# EasyEDA Pro project ProPrj_Zephyr_2026-01-05.epro, board PCB1_4
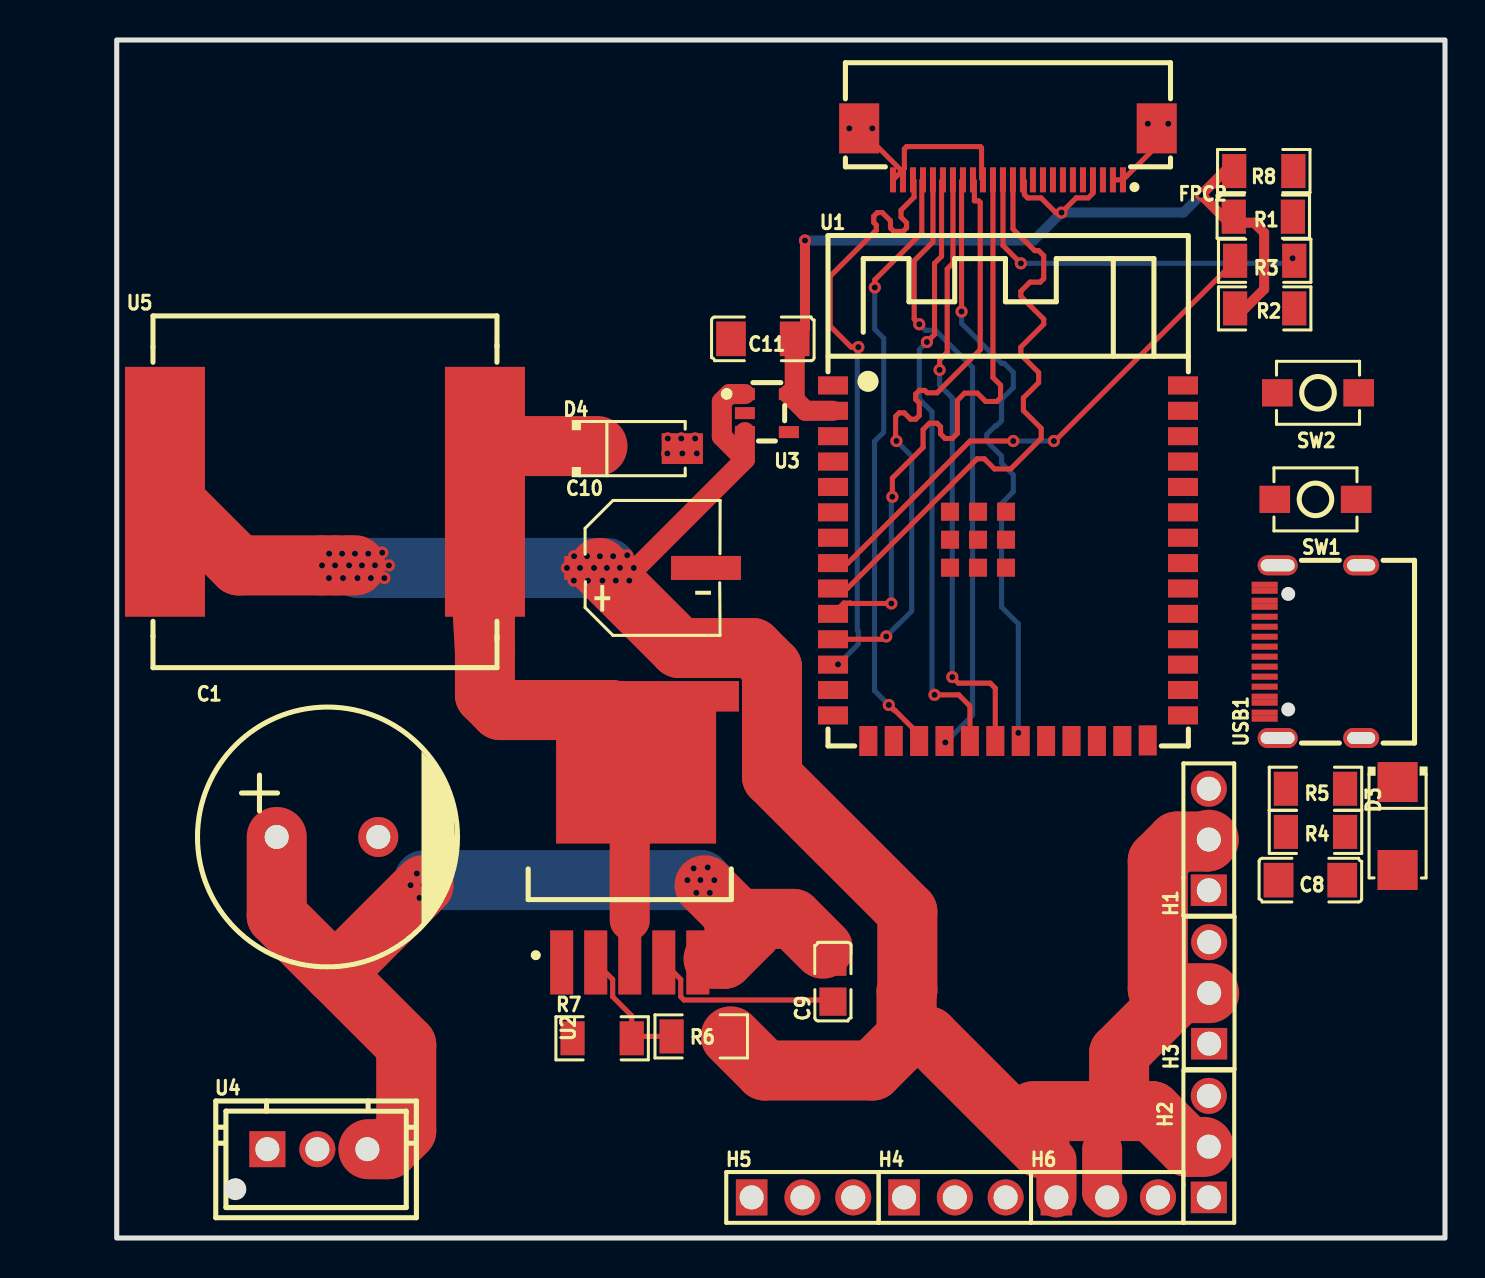
[diagram p5: board, top side]
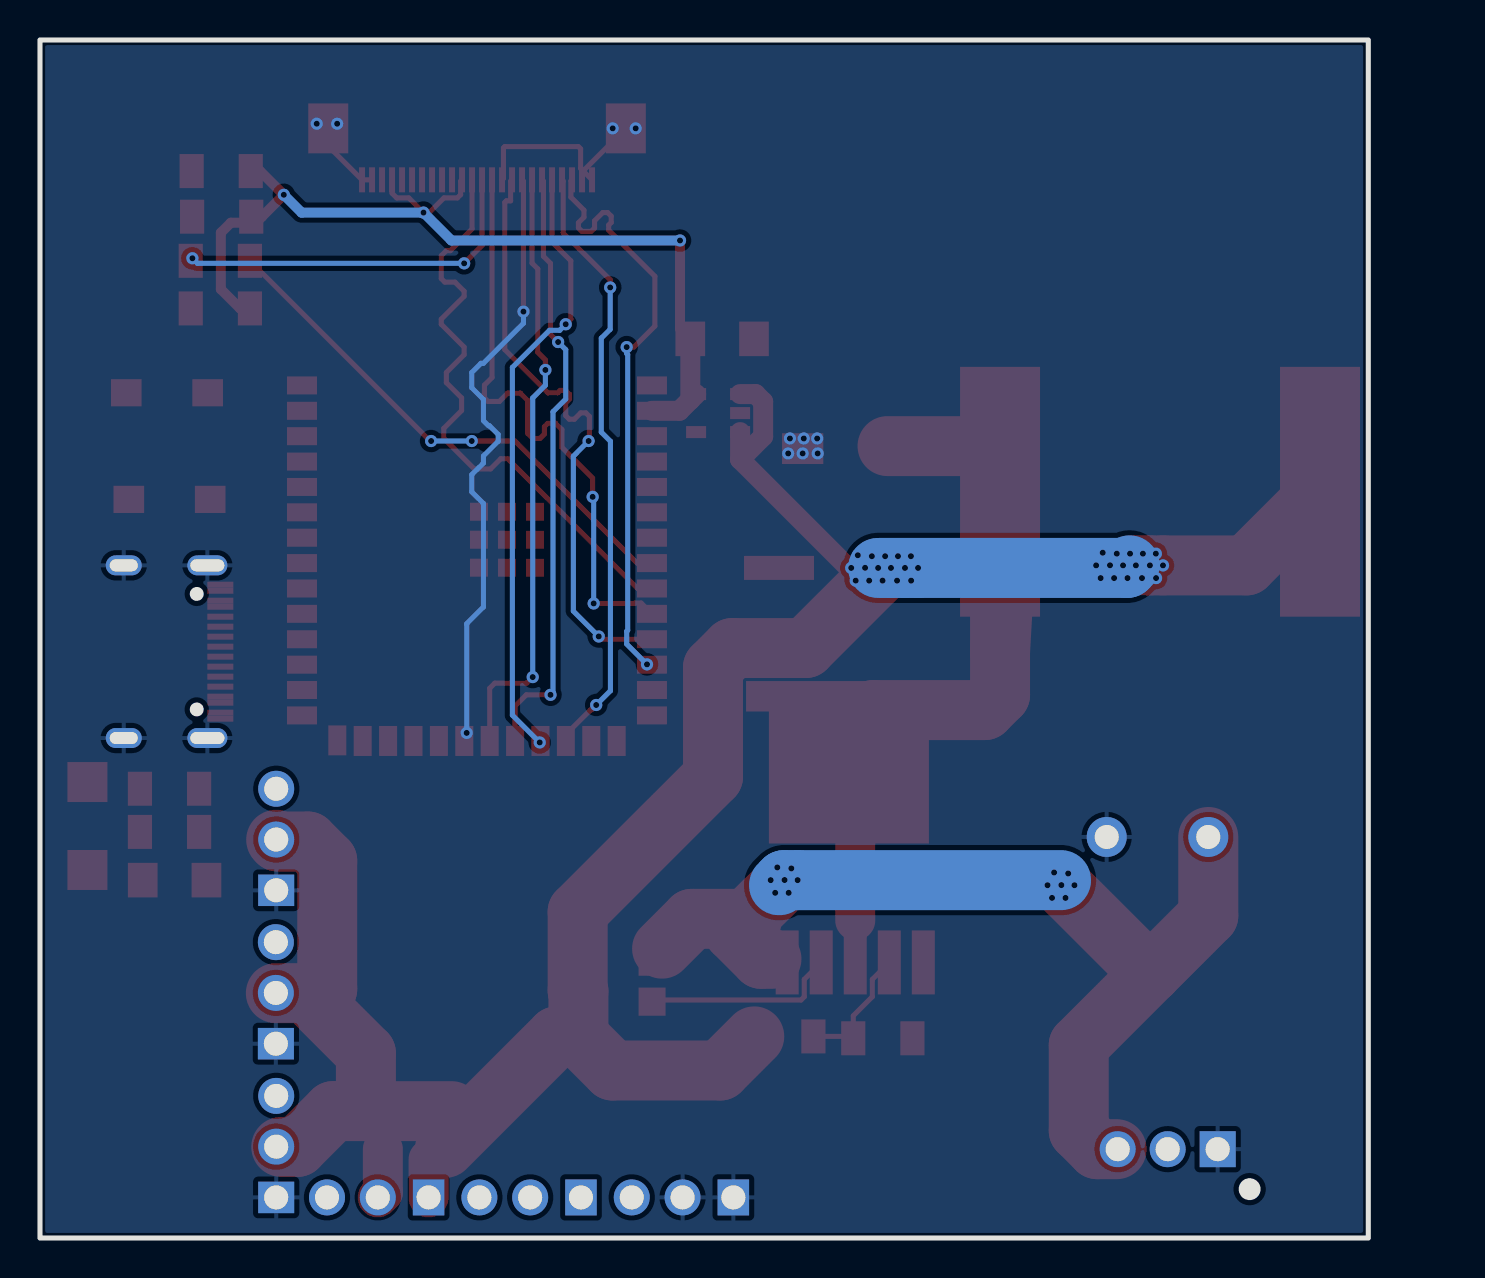
[diagram p6: board, bottom side, seen from below]

Outline 66.42 x 59.94 mm; copper layers: Top Layer, Bottom Layer. Coordinates in mm from the lower left corner of the outline.
Outline path: rectangle 0,59.94 66.42,0
Stack: Top Layer 0.035mm / Dielectric1 1.51mm FR4 er 4.5 / Bottom Layer 0.035mm

## Design rules (mm)
template: Custom Config
spacing copperThickness1oz (default): track to track 0.102, other pairs 0.152 to 0.3
spacing copperThickness2oz: track to track 0.203, other pairs 0.152 to 0.3
track width copperThickness1oz (default): min 0.127, default 0.254, max 2.54
track width copperThickness2oz: min 2, default 3, max 5
differential pair differentialPair (default): width min 0.127, default 0.254, max 2.54; gap min 0.152, default 0.152
via viaSize (default): diameter min 0.5, default 0.61, max 10; hole min 0.3, default 0.305, max 6.3

## Placement (name value [footprint] x y rotation side)
C1  2200uF  [CAP-TH_BD13.0-P5.00-D1.2-FD]  10.54 20.07 0 top
C8  1uF  [C1206]  59.69 17.91 0 top
C9  1uF  [C0805]  35.81 12.83 90 top
C10  470uF  [CAP-SMD_BD6.3-L6.6-W6.6-LS7.6-RD]  26.8 33.53 0 top
C11  1uF  [C1206]  32.31 44.99 180 top
D3  SS14-E3/61T  [SMA_L4.3-W2.6-LS5.2-RD]  64.05 20.62 270 top
D4  SS54  [SMA_L4.4-W2.8-LS5.4-R-RD]  25.78 39.5 0 top
FPC2  FPC-05F-24PH20  [FPC-SMD_24P-P0.50_FPC-05F-24PH20]  44.57 54.23 180 top
H1  2.54-1*3P针  [HDR-TH_3P-P2.54-V-M-1]  54.61 19.94 90 top
H2  2.54-1*3P针  [HDR-TH_3P-P2.54-V-M-1]  54.61 4.57 90 top
H3  2.54-1*3P针  [HDR-TH_3P-P2.54-V-M-1]  54.63 12.26 90 top
H4  2.54-1*3P针  [HDR-TH_3P-P2.54-V-M-1]  41.91 2.03 0 top
H5  2.54-1*3P针  [HDR-TH_3P-P2.54-V-M-1]  34.29 2.03 0 top
H6  2.54-1*3P针  [HDR-TH_3P-P2.54-V-M-1]  49.53 2.03 0 top
R1  4.7kΩ  [R1206]  57.34 51.1 0 top
R2  4.7kΩ  [R1206]  57.4 46.51 0 top
R3  33Ω  [R1206]  57.4 48.9 0 top
R4  5.1kΩ  [R1206]  59.94 20.32 180 top
R5  5.1kΩ  [R1206]  59.94 22.48 0 top
R6  10kΩ  [R1206]  29.23 10.09 0 top
R7  3.3kΩ  [R1206]  24.27 9.99 0 top
R8  10kΩ  [R1206]  57.36 53.39 180 top
SW1  HX 3x4x2-2P-2.5N  [SW-SMD_L4.0-W2.9-LS5.0]  59.94 36.96 0 top
SW2  HX 3x4x2-2P-2.5N  [SW-SMD_L4.0-W2.9-LS5.0]  60.07 42.29 0 top
U1  ESP32-S3-WROOM-1-N8R8  [WIRELM-SMD_ESP32-S3-WROOM-1]  44.57 33.76 0 top
U2  XL4015E1  [TO-263-5_L10.2-W8.9-P1.70-TL]  25.65 18.8 90 top
U3  AP2112K-3.3TRG1  [SOT-23-5_L2.9-W1.6-P0.95-LS2.8-BR]  32.51 41.28 180 top
U4  B3B-XH-AM(LF)(SN)  [CONN-TH_3P-P2.50_B3B-XH-AM-LF-SN]  10.03 4.45 0 top
U5  47uH  [IND-SMD_L17.5-W17.2]  10.41 37.34 0 top
USB1  KH-TYPE-C-16P  [USB-C-SMD_KH-TYPE-C-16P]  59.82 29.34 90 top

## Footprints (pads in the part's own frame, mm; a bottom-side part is the same pattern mirrored in y, then rotated)
C0805
  rect 1.41x1.35 smd: 1(-1,0) 2(1,0)
C1206
  rect 1.485x1.728 smd: 1(-1.593,0) 2(1.593,0)
CAP-SMD_BD6.3-L6.6-W6.6-LS7.6-RD
  rect 3.5x1.2 smd: 1(-2.67,0) 2(2.67,0)
CAP-TH_BD13.0-P5.00-D1.2-FD
  round 2 hole 1.2: 1(-2.54,0) 2(2.54,0)
CONN-TH_3P-P2.50_B3B-XH-AM-LF-SN
  rect 1.8x1.8 hole 1.2: 1(-2.5,0)
  round 1.8 hole 1.2: 2(0,0) 3(2.5,0)
FPC-SMD_24P-P0.50_FPC-05F-24PH20
  rect 0.3x1.25 smd: 1(-5.75,1.288) 2(-5.25,1.288) 3(-4.75,1.288) 4(-4.25,1.288) 5(-3.75,1.288) 6(-3.25,1.288) 7(-2.75,1.288) 8(-2.25,1.288) 9(-1.75,1.288) 10(-1.25,1.288) 11(-0.75,1.288) 12(-0.25,1.288) 13(0.25,1.288) 14(0.75,1.288) 15(1.25,1.288) 16(1.75,1.288) 17(2.25,1.288) 18(2.75,1.288) 19(3.25,1.288) 20(3.75,1.288) 21(4.25,1.288) 22(4.75,1.288) 23(5.25,1.288) 24(5.75,1.288)
  rect 2x2.5 smd: 25(7.44,-1.288) 26(-7.44,-1.288)
HDR-TH_3P-P2.54-V-M-1
  rect 1.575x1.8 hole 1.2: 1(-2.54,0)
  round 1.8 hole 1.2: 2(0,0) 3(2.54,0)
IND-SMD_L17.5-W17.2
  rect 4x12.5 smd: 1(-8,0) 2(8,0)
R1206
  rect 1.208x1.701 smd: 1(-1.479,0) 2(1.479,0)
SMA_L4.3-W2.6-LS5.2-RD
  rect 2x2 smd: 1(-2.2,0) 2(2.2,0)
SMA_L4.4-W2.8-LS5.4-R-RD
  rect 2.062x1.539 smd: 1(2.503,0) 2(-2.503,0)
SOT-23-5_L2.9-W1.6-P0.95-LS2.8-BR
  rect 1x0.6 smd: 1(1.1,-0.95) 2(1.1,0) 3(1.1,0.95) 4(-1.1,0.95) 5(-1.1,-0.95)
SW-SMD_L4.0-W2.9-LS5.0
  rect 1.53x1.36 smd: 1(-2.035,0) 2(2.035,0)
TO-263-5_L10.2-W8.9-P1.70-TL
  rect 3.2x1.15 smd: 1(-5.008,3.404) 2(-5.008,1.702) 3(-5.008,0) 4(-5.008,-1.702) 5(-5.008,-3.404)
  custom 8.128x10.922 smd: 6(5.008,-0.318)
USB-C-SMD_KH-TYPE-C-16P
  oval 1x2 hole 0.6x1.7: 1(-4.32,1.765) 2(4.32,1.765)
  oval 1x1.8 hole 0.6x1.4: 3(-4.32,-2.415) 4(4.32,-2.415)
  rect 0.3x1.3 smd: A1(-3.35,2.415) A4(-2.55,2.415) A5(-1.25,2.415) A6(-0.25,2.415) A7(0.25,2.415) A8(1.25,2.415) A9(2.55,2.415) A12(3.35,2.415) B1(3.05,2.415) B4(2.25,2.415) B5(1.75,2.415) B6(0.75,2.415) B7(-0.75,2.415) B8(-1.75,2.415) B9(-2.25,2.415) B12(-3.05,2.415)
WIRELM-SMD_ESP32-S3-WROOM-1
  rect 1.5x0.9 smd: 1(-8.75,8.895) 2(-8.75,7.625) 3(-8.75,6.355) 4(-8.75,5.085) 5(-8.75,3.815) 6(-8.75,2.545) 7(-8.75,1.275) 8(-8.75,0.005) 9(-8.75,-1.265) 10(-8.75,-2.535) 11(-8.75,-3.805) 12(-8.75,-5.075) 13(-8.75,-6.345) 14(-8.75,-7.615) 27(8.75,-7.615) 28(8.75,-6.345) 29(8.75,-5.075) 30(8.75,-3.805) 31(8.75,-2.535) 32(8.75,-1.265) 33(8.75,0.005) 34(8.75,1.275) 35(8.75,2.545) 36(8.75,3.815) 37(8.75,5.085) 38(8.75,6.355) 39(8.75,7.625) 40(8.75,8.895)
  rect 0.9x1.5 smd: 15(-6.985,-8.895) 16(-5.715,-8.895) 17(-4.445,-8.895) 18(-3.175,-8.895) 19(-1.905,-8.895) 20(-0.635,-8.895) 21(0.635,-8.895) 22(1.905,-8.895) 23(3.175,-8.895) 24(4.445,-8.895) 25(5.715,-8.895) 26(6.985,-8.865)
  rect 0.9x0.9 smd: 41(-2.9,2.575) 41(-2.9,1.175) 41(-2.9,-0.225) 41(-1.5,2.575) 41(-1.5,1.175) 41(-1.5,-0.225) 41(-0.1,2.575) 41(-0.1,1.175) 41(-0.1,-0.225)

## Nets
As in the schematic.

Pads without a net: FPC2 10; U1 15 26 28 29 30 36 37; U3 4; U4 2; USB1 A8 B8

## Via types
v1: diameter 0.61, hole 0.305, Top Layer to Bottom Layer, 79 vias

## Routing (per net, layer and track width the routed paths; a pad name or vN(x,y) marks a point on that pad's centre or on a via; arc(x,y) is an arc through that point)
3.3V: length 48.4
  Top Layer w0.254: FPC2.11 45.39,52.88 45.39,52.21 45.55,52.04 46.22,52.04 46.95,51.31 v1(47.24,51.31) 47.98,52.04 48.58,52.04 48.82,52.28 FPC2.4
  Top Layer w0.5: C11.1 34.42,45.5 v1(34.42,49.91) ; 55.32,51.1 R1.1 ; 55.32,51.1 v1(54.23,52.2) 55.42,53.39 R8.2 ; 55.32,51.1 55.63,50.8 56.88,50.8 57.38,50.3 57.38,47.47 56.42,46.51 55.93,46.51
  Top Layer w1: U1.2 34.45,41.39 33.9,41.93 ; U3.5 33.9,41.93 ; 33.9,41.93 C11.1
  Bottom Layer w0.5: v1(34.42,49.91) 45.85,49.91 v1(47.24,51.31) 53.34,51.31 v1(54.23,52.2)
5V: length 121
  Top Layer w1: 31.41,42.23 30.64,42.23 30.26,41.85 30.26,40.11 31.41,38.96 ; v1(25.86,33.53) 25.98,33.53 31.41,38.96 ; 31.41,40.32 31.41,38.96
  Top Layer w2: H6.2 49.28,2.29 49.28,4.45 ; H2.2 54.49,4.69 ; 46.99,3.94 H6.1
  Top Layer w3: 54.63,12.25 53.13,12.25 50.12,9.25 50.12,6.35 ; R6.2 32.41,8.38 37.79,8.38 39.5,10.09 ; 50.12,6.35 51.76,6.35 53.55,4.56 54.36,4.56 ; 50.12,6.35 45.85,6.35 ; 39.5,10.09 40.58,10.09 46.16,4.51 ; 39.5,10.09 39.5,12.35 39.54,12.39 39.54,16.32 32.77,23.09 32.77,28.55 31.8,29.52 28.14,29.52 C10.1 ; 52.32,12.19 52.06,12.46 52.06,18.87 53.03,19.84 54.52,19.84 54.61,19.93 ; U5.1 6.1,33.66 v1(10.27,33.66) v1(10.92,33.66) v1(11.62,33.66) 11.94,33.66
  Bottom Layer w3: 11.94,33.66 12.06,33.53 v1(22.51,33.53) v1(23.17,33.53) v1(23.87,33.53) v1(24.51,33.53)
  vias: v1(10.62,34.24) v1(10.61,33.02) v1(11.27,34.24) v1(11.32,33.02) v1(11.91,34.24) v1(12.04,33.02) v1(12.26,33.66) v1(12.58,34.24) v1(12.71,33.02) v1(12.92,33.66) v1(13.28,34.29) v1(13.38,33.02) v1(13.61,33.66) v1(22.87,34.12) v1(22.86,32.89) v1(23.52,34.12) v1(23.56,32.89) v1(24.16,34.12) v1(24.29,32.89) v1(24.82,34.12) v1(24.96,32.89) v1(25.16,33.53) v1(25.53,34.16) v1(25.63,32.89)
GND: length 14.6
  Top Layer w0.254: 39.26,53.39 39.32,53.33 FPC2.23 ; 39.26,53.39 39.39,53.52 39.39,54.5 39.5,54.61 43.18,54.61 43.25,54.54 43.25,53.02 FPC2.15 ; 39.26,53.39 FPC2.24 ; 39.26,53.39 FPC2.25 ; FPC2.26 52.01,54.64 FPC2.1 FPC2.2
  vias: v1(27.56,40.01) v1(27.53,39.26) v1(28.23,40.01) v1(28.28,39.26) v1(28.92,40.01) v1(29.01,39.26) v1(36.63,55.52) v1(37.78,55.52) v1(51.56,55.75) v1(52.58,55.75)
BAT+: length 51
  Top Layer w3: 29.84,13.97 30.36,13.97 31.72,15.33 31.08,15.97 ; 30.86,15.75 31.08,15.97 ; 31.08,15.97 33.82,15.97 35.31,14.48 ; 31.08,15.97 29.4,17.65 ; C1.1 8,16.13 10.86,13.27 ; v1(15.35,17.66) 10.96,13.27 10.86,13.27 ; 12.59,4.45 13.55,4.45 14.48,5.37 14.48,9.65 10.86,13.27
  Bottom Layer w3: 29.46,17.65 29.21,17.91 v1(28.54,17.91) 15.37,17.91
  vias: v1(14.69,17.65) v1(15.01,18.24) v1(15.14,17.02) v1(15.71,18.29) v1(15.82,17.02) v1(16.04,17.65) v1(28.85,18.49) v1(28.98,17.27) v1(29.19,17.91) v1(29.55,18.54) v1(29.66,17.27) v1(29.88,17.91)
GPIO8-D: length 29.9
  Top Layer w0.254: FPC2.22 39.87,52.89 39.87,52.08 39.22,51.43 39.22,51.08 39.5,50.8 39.5,50.55 39.32,50.37 38.86,50.37 38.69,50.54 38.69,50.9 38.28,51.31 38.04,51.31 37.86,51.13 37.86,50.81 37.98,50.68 37.98,50.43 35.67,48.12 35.67,45.63 36.72,44.58 v1(37.08,44.58)
  Bottom Layer w0.254: v1(36.07,28.7) 37.08,29.72 37.08,30.36 37.03,30.41 37.03,44.2 37.08,44.26 v1(37.08,44.58)
GPIO9-D: length 30.4
  Top Layer w0.254: FPC2.21 40.26,52.89 40.26,50.29 37.91,47.94 v1(37.91,47.56) ; v1(38.61,26.67) 38.86,26.42 38.9,26.42 40,25.32 40,25 U1.17
  Bottom Layer w0.254: v1(37.91,47.56) 37.91,45.47 38.35,45.02 38.35,40.32 37.9,39.87 37.9,27.38 v1(38.61,26.67)
GPIO10-D: length 30.7
  Top Layer w0.254: U1.18 41.39,24.84 v1(41.43,24.8) ; FPC2.20 40.82,49.83 39.88,48.9 39.88,45.97 v1(40.13,45.72)
  Bottom Layer w0.254: v1(40.13,45.72) 40.44,45.42 40.94,45.42 42.8,43.56 42.8,26.16 v1(41.43,24.8)
GPIO11-D: length 30.3
  Top Layer w0.254: FPC2.19 41.25,52.88 41.25,49.12 40.89,48.77 40.89,45.21 v1(40.51,44.83) ; U1.19 42.66,26.62 42.1,27.18 v1(40.89,27.18)
  Bottom Layer w0.254: v1(40.89,27.18) 40.77,27.31 40.77,41.34 40.13,41.98 40.13,44.45 v1(40.51,44.83)
GPIO12-D: length 30.4
  Top Layer w0.254: FPC2.18 41.82,48.78 41.53,48.49 41.53,44.31 41.15,43.93 v1(41.15,43.43) ; U1.20 43.93,27.51 43.68,27.76 42.09,27.76 v1(41.78,28.07)
  Bottom Layer w0.254: v1(41.15,43.43) 41.15,42.67 41.78,42.03 v1(41.78,28.07)
GPIO13: length 30.6
  Top Layer w0.254: FPC2.17 42.25,52.88 v1(42.25,46.36)
  Bottom Layer w0.254: v1(45.09,25.27) 45.09,30.73 44.25,31.57 44.25,36.75 44.83,37.34 44.83,38.19 44.25,38.77 44.25,39.13 43.51,39.86 43.51,40.21 43.94,40.64 43.99,40.64 44.25,40.89 44.25,41.96 44.83,42.55 44.83,43.31 44.37,43.76 44.25,43.76 42.25,45.77 v1(42.25,46.36)
GPIO15: length 26.4
  Top Layer w0.254: U1.8 36.56,33.77 42.67,39.88 v1(44.83,39.88) ; 55.93,48.9 46.91,39.88 v1(46.86,39.88)
  Bottom Layer w0.254: v1(46.86,39.88) v1(44.83,39.88)
GPIO16-D: length 30.4
  Top Layer w0.254: U1.9 36.53,32.5 43.02,38.99 43.38,38.99 43.89,38.48 44.7,38.48 46.23,40.01 46.23,40.51 45.34,41.4 45.34,42.04 46.1,42.8 46.1,43.31 45.21,44.2 45.21,44.58 46.36,45.72 46.36,45.97 45.21,47.12 45.21,47.37 45.67,47.83 46.18,47.83 46.36,48.01 46.36,49.15 46.1,49.4 45.9,49.4 44.82,50.49 FPC2.12
GPIO17-D: length 30.3
  Top Layer w0.254: v1(38.79,37.08) 38.79,38.02 40.32,39.56 40.32,40.45 40.64,40.77 41.02,40.77 41.2,40.59 41.2,40.23 41.42,40.01 41.78,40.01 42.04,40.26 42.04,41.91 42.4,42.27 43.03,42.27 43.45,41.86 44.02,41.86 44.2,42.04 44.2,42.68 43.82,43.05 FPC2.14 ; U1.10 36.36,31.77 36.69,31.77 36.71,31.75 v1(38.74,31.75)
  Bottom Layer w0.254: v1(38.74,31.75) 38.74,37.03 v1(38.79,37.08)
GPIO18-D: length 30.2
  Top Layer w0.254: U1.11 38.34,29.96 v1(38.48,30.1) ; v1(38.99,39.88) 38.95,39.92 38.95,41.11 39.13,41.29 39.38,41.29 39.7,40.97 39.95,40.97 40.13,41.15 40.13,41.78 39.95,41.97 39.95,42.22 40.14,42.41 40.41,42.41 40.53,42.29 41.02,42.29 43.18,44.45 43.18,51.82 43.1,51.9 42.89,51.9 42.89,52.88 FPC2.16
  Bottom Layer w0.254: v1(38.48,30.1) 39.75,31.37 39.75,39.12 v1(38.99,39.88)
GPIO21: length 6.6
  Top Layer w0.254: R6.1 25.85,10.09 R7.2 25.75,11.12 24.8,12.07 24.8,12.94 U2.2
$1N1141: length 18.2
  Top Layer w0.254: v1(45.21,48.77) 44.32,49.66 44.32,52.95
  Bottom Layer w0.254: v1(58.8,49.02) 58.55,48.77 v1(45.21,48.77)
$1N2437: length 9.8
  Top Layer w0.254: U2.4 28.2,12.94 28.2,12.07 28.37,11.91 35.73,11.91 C9.1
$1N2590: length 41.6
  Top Layer w2: U2.6 25.65,23.49 25.65,15.89
  Top Layer w3: 18.41,34 18.16,33.75 18.41,29.34 ; 18.41,34 18.41,29.34 ; 18.41,34 18.41,39.57 18.47,39.62 24.04,39.62 ; 18.41,29.34 18.41,27.18 19.18,26.42 24.76,26.42 27.62,23.55

## Copper pours and planes (outline as drawn; the poured copper is in the pictures)
GND on Bottom Layer: 0,59.94 66.42,59.94 66.42,0 0,0
